# EAGLE design ext_breadboard_M (EAGLE 9.6.2)
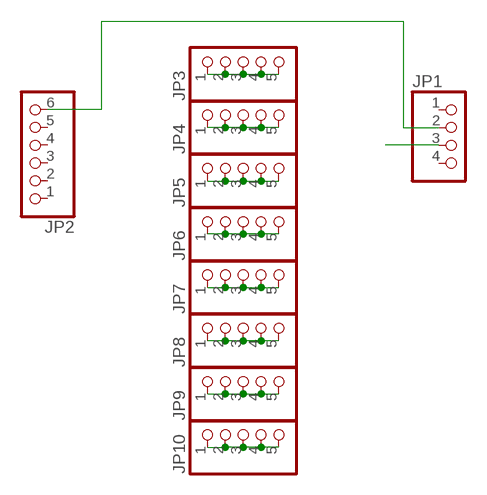
[diagram p0: schematic, sheet 1]

## Parts
JP1  PINHD-1X4  [1X04]
JP2  PINHD-1X6  [1X06]
JP3  PINHD-1X5  [1X05]
JP4  PINHD-1X5  [1X05]
JP5  PINHD-1X5  [1X05]
JP6  PINHD-1X5  [1X05]
JP7  PINHD-1X5  [1X05]
JP8  PINHD-1X5  [1X05]
JP9  PINHD-1X5  [1X05]
JP10  PINHD-1X5  [1X05]

## Nets
GND: JP1.2 JP2.6
N$1: JP3.1 JP3.2 JP3.3 JP3.4 JP3.5
N$2: JP4.1 JP4.2 JP4.3 JP4.4 JP4.5
N$3: JP5.1 JP5.2 JP5.3 JP5.4 JP5.5
N$4: JP6.1 JP6.2 JP6.3 JP6.4 JP6.5
N$5: JP7.1 JP7.2 JP7.3 JP7.4 JP7.5
N$6: JP8.1 JP8.2 JP8.3 JP8.4 JP8.5
N$7: JP9.1 JP9.2 JP9.3 JP9.4 JP9.5
N$8: JP10.1 JP10.2 JP10.3 JP10.4 JP10.5
VDD: JP1.3
Unconnected: JP1.1 JP1.4 JP2.1 JP2.2 JP2.3 JP2.4 JP2.5

## Library data of the parts
JP1 = pinhead2:PINHD-1X4: PIN HEADER
JP2 = pinhead2:PINHD-1X6: PIN HEADER
JP3-JP10 = pinhead2:PINHD-1X5: PIN HEADER

## Board
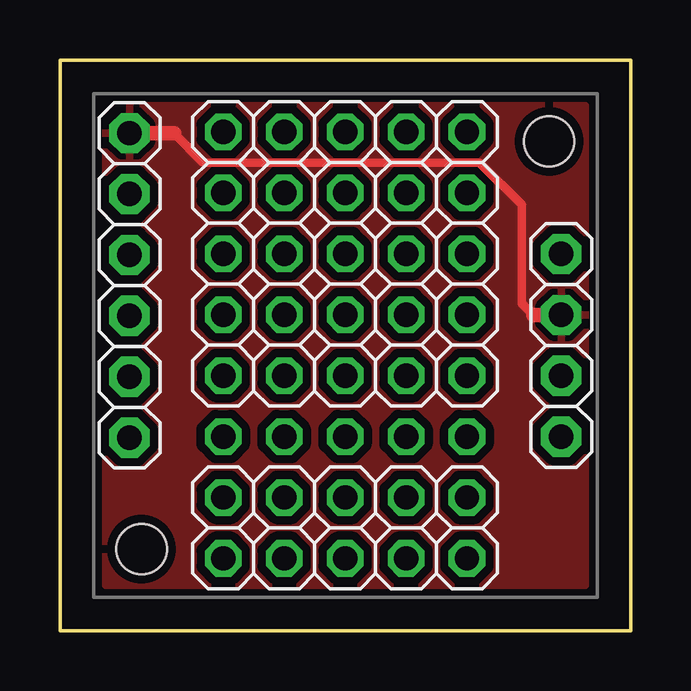
[diagram p1: board, top side]
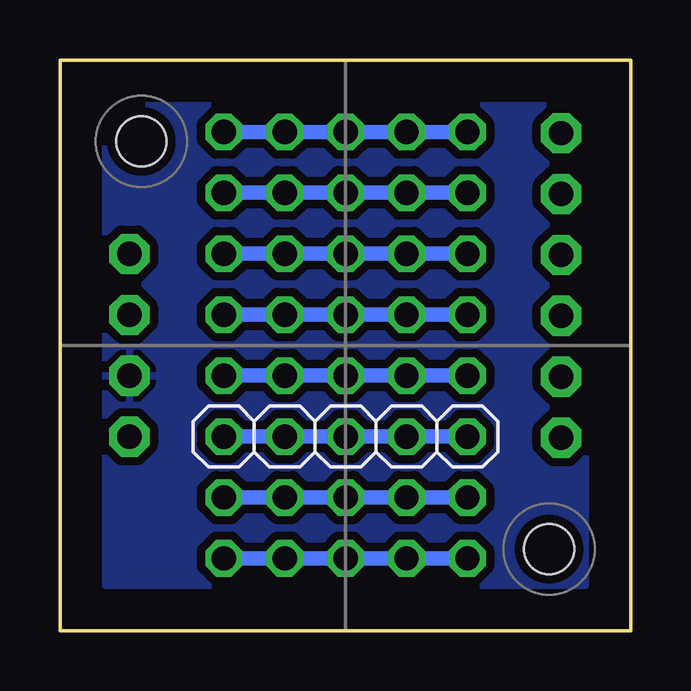
[diagram p2: board, bottom side, seen from below]

Size 23.8 x 23.8 mm. Coordinates in mm from the lower left corner, seen from the top.
Outline: 0,0 23.8,0 23.8,23.8 0,23.8 0,0
Copper layers (1*16): Top 0.035mm / dielectric 1.5mm / Bottom 0.035mm
Design rules "default *": minimum track width 14mil, minimum drill 0.35mm, track to track 14mil, track to pad 13mil, pad to pad 14mil, via to via 14mil, smd to smd 14mil, copper to edge 15mil, drill to drill 15mil, minimum pad ring 10mil, minimum via ring 8mil, stop-mask expansion 4mil, vias tented up to drill 0mil, thermal gap 10mil
Holes 2.1 mm at 20.4,20.4 3.4,3.4

### Footprints (pad centres in the part's own frame; a part is rotated, then mirrored left to right if it is on the bottom)
1X04 = drill 1.016 pad 1.676 octagon: 1 -3.81,0; 2 -1.27,0; 3 1.27,0; 4 3.81,0
1X06 = drill 1.016 pad 1.676 octagon: 1 -6.35,0; 2 -3.81,0; 3 -1.27,0; 4 1.27,0; 5 3.81,0; 6 6.35,0
1X05 = drill 1.016 octagon: 1 -5.08,0; 2 -2.54,0; 3 0,0; 4 2.54,0; 5 5.08,0

### Placement (x,y rotation side)
JP1  20.9,11.9 270 top
JP2  2.9,14.4 90 top
JP3  11.89,20.8 0 top
JP4  11.89,18.26 0 top
JP5  11.89,15.72 0 top
JP6  11.89,13.18 0 top
JP7  11.89,10.64 0 top
JP8  11.89,8.1 0 bottom
JP9  11.89,5.56 0 top
JP10  11.89,3.02 0 top

### Tracks (layer width: path | path; a pad name or v marks a point on that pad's centre or on a via)
GND
  Top 0.356: 19.74,13.17 19.25,13.65 19.25,17.77 17.5,19.53 5.97,19.53 4.75,20.75
  Top 0.61: JP2.6 4.75,20.75 | JP1.2 19.74,13.17
  pour Top (isolate 0.305): 1.9,21.9 21.9,21.9 21.9,1.9 1.9,1.9
N$1
  Bottom 0.61: JP3.1 JP3.2 JP3.3 JP3.4 JP3.5
N$2
  Bottom 0.61: JP4.5 JP4.4 JP4.3 JP4.2 JP4.1
N$3
  Bottom 0.61: JP5.1 JP5.2 JP5.3 JP5.4 JP5.5
N$4
  Bottom 0.61: JP6.5 JP6.4 JP6.3 JP6.2 JP6.1
N$5
  Bottom 0.61: JP7.1 JP7.2 JP7.3 JP7.4 JP7.5
N$6
  Bottom 0.61: JP8.1 JP8.2 JP8.3 JP8.4 JP8.5
N$7
  Bottom 0.61: JP9.1 JP9.2 JP9.3 JP9.4 JP9.5
N$8
  Bottom 0.61: JP10.5 JP10.4 JP10.3 JP10.2 JP10.1
VDD
  pour Bottom (isolate 0.305): 1.9,21.9 21.9,21.9 21.9,1.9 1.9,1.9

### Text on the board
bDocu: bredboard M.0